# Altium schematic sheet RS422.SchDoc
size A4
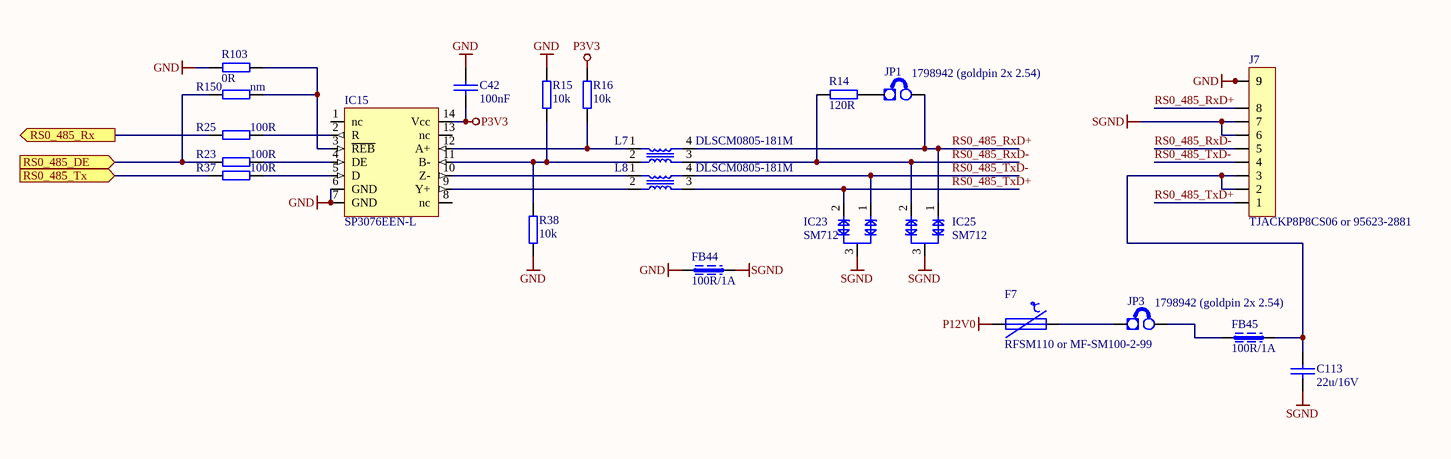
[diagram p0: RS422.SchDoc]

## Parts
C42  100nF  [0402C]
C113  22u/16V  [1206C]
F7  RFSM110 or MF-SM100-2-99  [SMD150-2]
FB44  100R/1A  [0603L]
FB45  100R/1A  [0603L]
IC15  SP3076EEN-L  [SO-14]
IC23  SM712  [SOT-23]
IC25  SM712  [SOT-23]
J7  TJACKP8P8CS06 or 95623-2881  [ETH_VERT_95623-2881]
JP1  1798942 (goldpin 2x 2.54)  [jump]
JP3  1798942 (goldpin 2x 2.54)  [jump]
L7  DLSCM0805-181M  [DLSCM0805]
L8  DLSCM0805-181M  [DLSCM0805]
R14  120R  [1206R]
R15  10k  [0402R]
R16  10k  [0402R]
R23  100R  [0402R]
R25  100R  [0402R]
R37  100R  [0402R]
R38  10k  [0402R]
R103  0R  [0603R]
R150  nm  [0402R]

## Ports
RS0_485_DE (in), RS0_485_Rx (out), RS0_485_Tx (in)

## Nets
GND: C42.1 FB44.1 IC15.6(GND) IC15.7(GND) J7.9a(9) J7.9b(9) R15.2 R38.1 R103.1
P3V3: C42.2 IC15.14(Vcc) R16.2
P12V0: F7.1
SGND: C113.2 FB44.2 IC23.3 IC25.3 J7.6 J7.7
RS0_485_DE: R23.1 R150.1 ; port RS0_485_DE
RS0_485_Rx: R25.1 ; port RS0_485_Rx
RS0_485_RxD+: IC25.1 J7.8 JP1.2(E2) L7.4
RS0_485_RxD-: IC25.2 J7.5 L7.3 R14.1
RS0_485_Tx: R37.1 ; port RS0_485_Tx
RS0_485_TxD+: IC23.2 J7.1 L8.3
RS0_485_TxD-: IC23.1 J7.4 L8.4
NetC113_1: C113.1 FB45.2 J7.2 J7.3
NetF7_2: F7.2 JP3.1(E1)
NetFB45_1: FB45.1 JP3.2(E2)
NetIC15_2: IC15.2(R) R25.2
NetIC15_3: IC15.3(~{REB}) R103.2 R150.2
NetIC15_4: IC15.4(DE) R23.2
NetIC15_5: IC15.5(D) R37.2
NetIC15_9: IC15.9(Y+) L8.2
NetIC15_10: IC15.10(Z-) L8.1
NetIC15_11: IC15.11(B-) L7.2 R15.1 R38.2
NetIC15_12: IC15.12(A+) L7.1 R16.1
NetJP1_1: JP1.1(E1) R14.2

Not connected (* = marked no-connect by the designer): IC15 1(nc) 8(nc) 13(nc)

## Library data of the parts
C42 = CAP_SMD_0402: Capacitor SMD; Supplier 1: Newark; Supplier Part Number 1: 14T3275
C113 = CAP_SMD_0805: Capacitor SMD
F7 = F_PTC_9.5x6mm: 2.50A/15V; Supplier 1: Newark; Supplier Part Number 1: 61J7435
FB44 FB45 = L_FERRITE_BEAD_0603: ferrite bead 100R@100MHz 1A; Supplier 1: Newark; Supplier Part Number 1: 89R3144
IC15 = DRV_SP3070/73/76: 3.3V, 1/8 Load, Failsafe  RS-485/RS422 Transceivers
IC23 IC25 = D_TVS_SM712: Asymmetrical TVS Diode for RS485
J7 = CON_MOD_8pin_V: Modular 8pin (Maritex or Molex)
JP1 JP3 = JUMPER: Supplier 1: Farnell; Supplier Part Number 1: 1798942
L7 L8 = L_CMC_DLSCM0805_180R: CMC 180R
R14 = RES_1206: SMD Resistor; Supplier 1: Newark; Supplier Part Number 1: 39K0871
R15 R16 R23 R25 R37 R38 R150 = RES_0402: SMD Resistor; Supplier 1: Newark; Supplier Part Number 1: 59M6691
R103 = RES_0603: SMD Resistor; Supplier 1: Newark; Supplier Part Number 1: 39K0073